# Altium schematic sheet Capteurs.SchDoc
size A3; Organization: Altium Limited; Address1: Laboratoire de Systèmes Embarqués; Address2: 7, rue de la Serre; Address3: 2610 Saint-Imier / Switzerland; PageSetup: Record=PageOptions|CenterHorizontal=True|CenterVertical=True|PrintScale=0.24|XCorrection=1.00|YCorrection=1.00|PrintKind=0|BorderSize=5000000|LeftOffset=0|BottomOffset=0|Orientation=2|PaperLength=1000|PaperWidth=1000|Scale=100|PaperSource=7|PrintQuality=-4|MediaType=1|DitherType=10|PaperKind=A4|PrintScaleMode=1
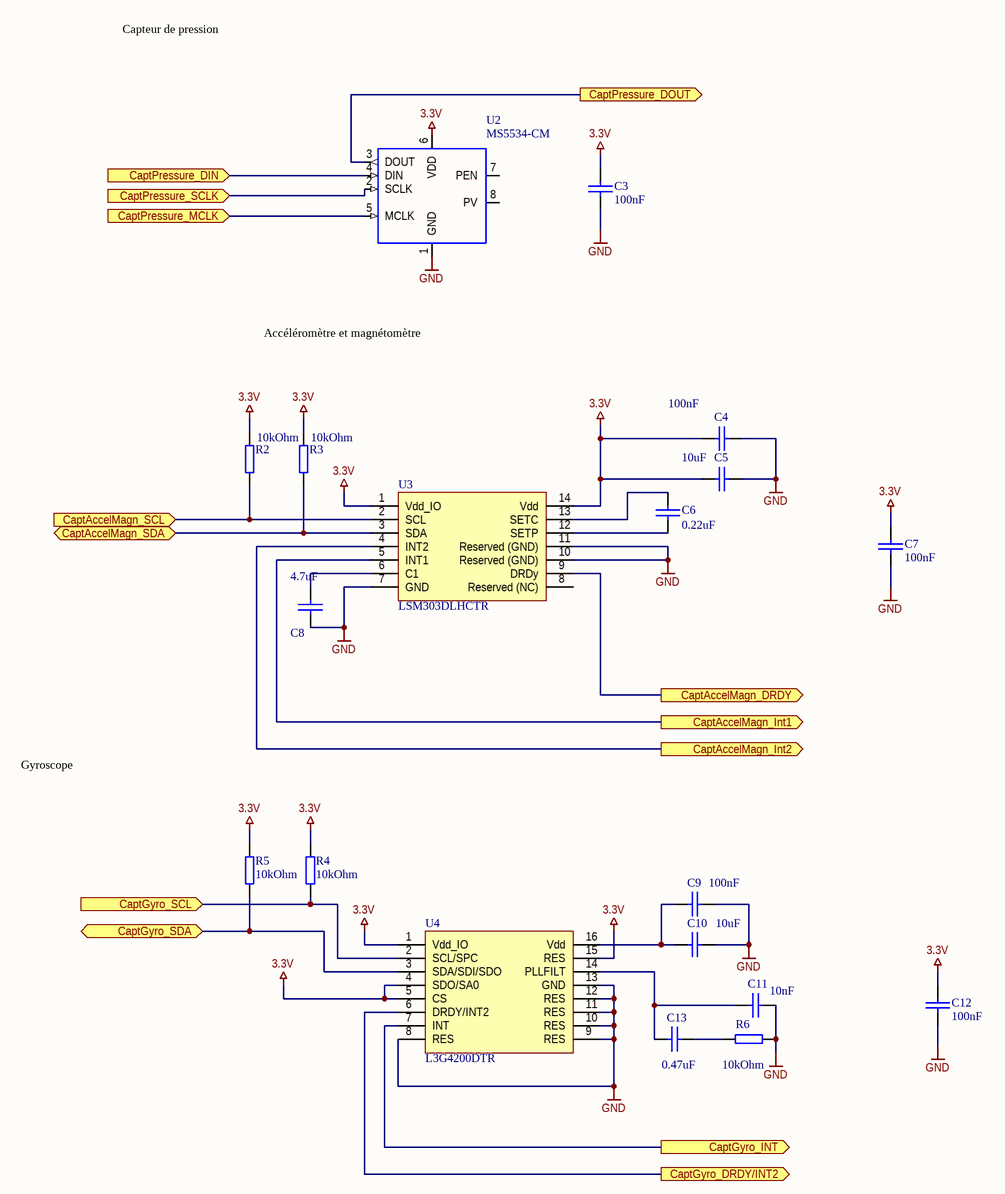
[diagram p0: Capteurs.SchDoc]

## Parts
C3  value 100nF  [060301]  (hidden comment: GRM188R71E104KA01D)
C4  value 100nF  [060301]  (hidden comment: GRM188R71E104KA01D)
C5  value 10uF  [080501]  (hidden comment: 08056D106KAT2A)
C6  value 0.22uF  [120601]  (hidden comment: UMK212F224ZD-T)
C7  value 100nF  [060301]  (hidden comment: GRM188R71E104KA01D)
C8  value 4.7uF  [080501]  (hidden comment: C0805C475K4PACTU)
C9  value 100nF  [060301]  (hidden comment: GRM188R71E104KA01D)
C10  value 10uF  [080501]  (hidden comment: 08056D106KAT2A)
C11  value 10nF  [080501]  (hidden comment: C0805C103K4RACTU)
C12  value 100nF  [060301]  (hidden comment: GRM188R71E104KA01D)
C13  value 0.47uF  [060301]  (hidden comment: C2012Y5V1H474Z/0.85)
R2  value 10kOhm  [080501]  (hidden comment: ERJ-6GEYJ103V)
R3  value 10kOhm  [080501]  (hidden comment: ERJ-6GEYJ103V)
R4  value 10kOhm  [080501]  (hidden comment: ERJ-6GEYJ103V)
R5  value 10kOhm  [080501]  (hidden comment: ERJ-6GEYJ103V)
R6  value 10kOhm  [080501]  (hidden comment: ERJ-6GEYJ103V)
U2  MS5534-CM  [MS5534B]
U3  LSM303DLHCTR  [LGA-14L]
U4  L3G4200DTR  [LGA-16]

## Ports
CaptAccelMagn_DRDY (out), CaptAccelMagn_Int1 (out), CaptAccelMagn_Int2 (out), CaptAccelMagn_SCL (in), CaptAccelMagn_SDA (bidir), CaptGyro_DRDY/INT2 (out), CaptGyro_INT (out), CaptGyro_SCL (in), CaptGyro_SDA (bidir), CaptPressure_DIN (in), CaptPressure_DOUT (out), CaptPressure_MCLK (in), CaptPressure_SCLK (in)

## Nets
3.3V: C3.1 C4.2 C5.2 C7.1 C12.1 R2.2 R3.2 R4.2 R5.2 U2.6(VDD) U3.1(Vdd_IO) U3.14(Vdd) U4.1(Vdd_IO) U4.4(SDO/SA0) U4.5(CS) U4.15(RES)
GND: C3.2 C4.1 C5.1 C7.2 C8.2 C9.1 C10.1 C11.1 C12.2 R6.2 U2.1(GND) U3.7(GND) U3.10(Reserved_(GND)) U3.11(Reserved_(GND)) U4.8(RES) U4.9(RES) U4.10(RES) U4.11(RES) U4.12(RES) U4.13(GND)
CaptAccelMagn_DRDY: U3.9(DRDy) ; port CaptAccelMagn_DRDY
CaptAccelMagn_Int1: U3.5(INT1) ; port CaptAccelMagn_Int1
CaptAccelMagn_Int2: U3.4(INT2) ; port CaptAccelMagn_Int2
CaptAccelMagn_SCL: R2.1 U3.2(SCL) ; port CaptAccelMagn_SCL
CaptAccelMagn_SDA: R3.1 U3.3(SDA) ; port CaptAccelMagn_SDA
CaptGyro_DRDY/INT2: U4.6(DRDY/INT2) ; port CaptGyro_DRDY/INT2
CaptGyro_INT: U4.7(INT) ; port CaptGyro_INT
CaptGyro_SCL: R4.1 U4.2(SCL/SPC) ; port CaptGyro_SCL
CaptGyro_SDA: R5.1 U4.3(SDA/SDI/SDO) ; port CaptGyro_SDA
CaptPressure_DIN: U2.4(DIN) ; port CaptPressure_DIN
CaptPressure_DOUT: U2.3(DOUT) ; port CaptPressure_DOUT
CaptPressure_MCLK: U2.5(MCLK) ; port CaptPressure_MCLK
CaptPressure_SCLK: U2.2(SCLK) ; port CaptPressure_SCLK
NetC6_1: C6.1 U3.12(SETP)
NetC6_2: C6.2 U3.13(SETC)
NetC8_1: C8.1 U3.6(C1)
NetC9_2: C9.2 C10.2 U4.16(Vdd)
NetC11_2: C11.2 C13.2 U4.14(PLLFILT)
NetC13_1: C13.1 R6.1

Not connected (* = marked no-connect by the designer): U2 7(PEN) 8(PV); U3 8(Reserved_(NC))

## Notes on the sheet
- Capteur de pression
- Accéléromètre et magnétomètre
- Gyroscope
- Title
- Size:
- Date:
- A3
- Author:
- Time:
- Revision:
- Sheet
- of
- File:

## Library data of the parts
C3-C5 C7-C13 = CAPA: EtatCommande: Interne; Text Field1: CAPA; Supplier 1: Digi-Key
  C3 C4 C7 C9 C12: Supplier Part Number 1: 490-1524-1-ND
  C5 C10: Supplier Part Number 1: 478-1417-1-ND
  C8: Supplier Part Number 1: C0805C475K4PACTU-ND
  C11: Supplier Part Number 1: C0805C103K4RACTU-ND
  C13: Supplier Part Number 1: 587-1250-1-ND
C6 = CAPA: EtatCommande: Commandé; Text Field1: CAPA; Supplier 1: Digi-Key; Supplier Part Number 1: 587-1306-1-ND
R2-R6 = RES: Text Field1: RESISTANCE; EtatCommande: Interne; Supplier 1: Digi-Key
  R2 R3 R5 R6: Supplier Part Number 1: P10KACT-ND
  R4: Supplier Part Number 1: P10KADKR-ND
U2 = MS5534B: Barometer Module; EtatCommande: Commandé; Supplier 1: Digi-Key; Supplier Part Number 1: 223-1100-1-ND
U3 = LSM303DLHC: Accéléromètre et magnétomètre; EtatCommande: Commandé; Supplier 1: Digi-Key; Supplier Part Number 1: 497-11918-1-ND
U4 = L3G4200D: Gyroscope; EtatCommande: Commandé; Part Name: L3G4200D; Supplier 1: Digi-Key; Supplier Part Number 1: 497-11071-1-ND